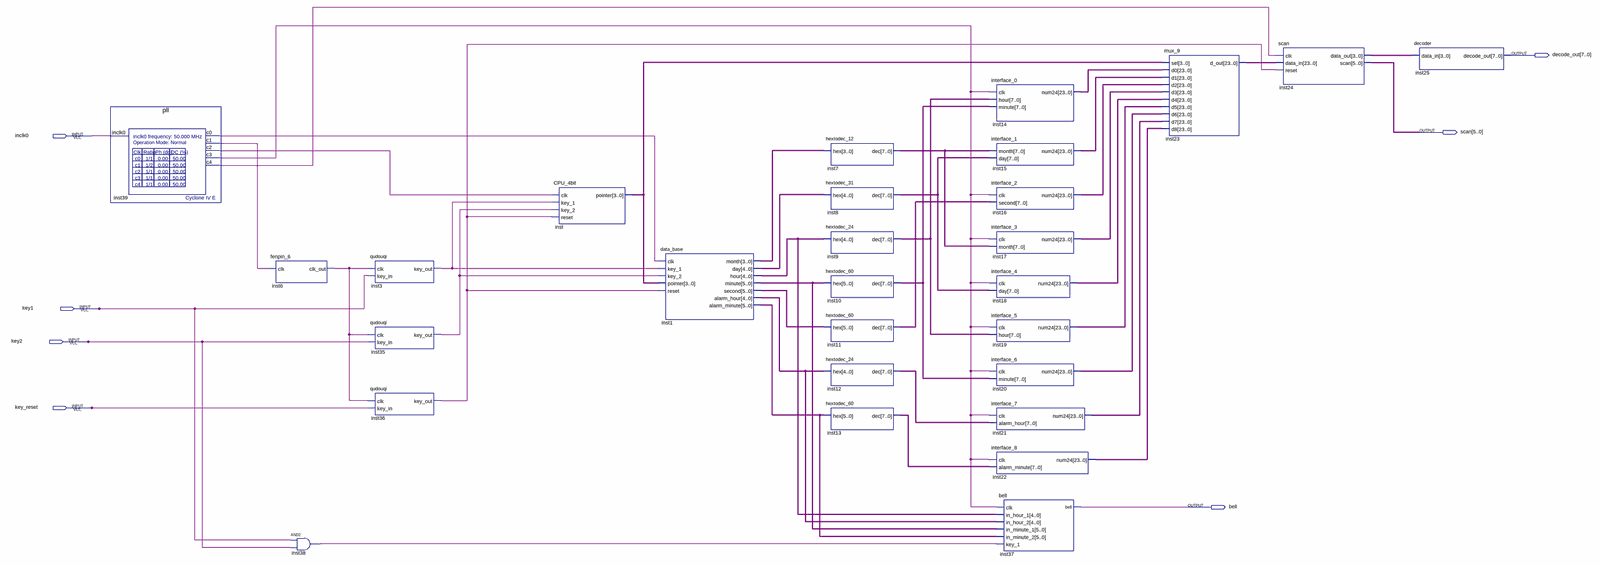
[diagram p0: schematic sheet, whole]
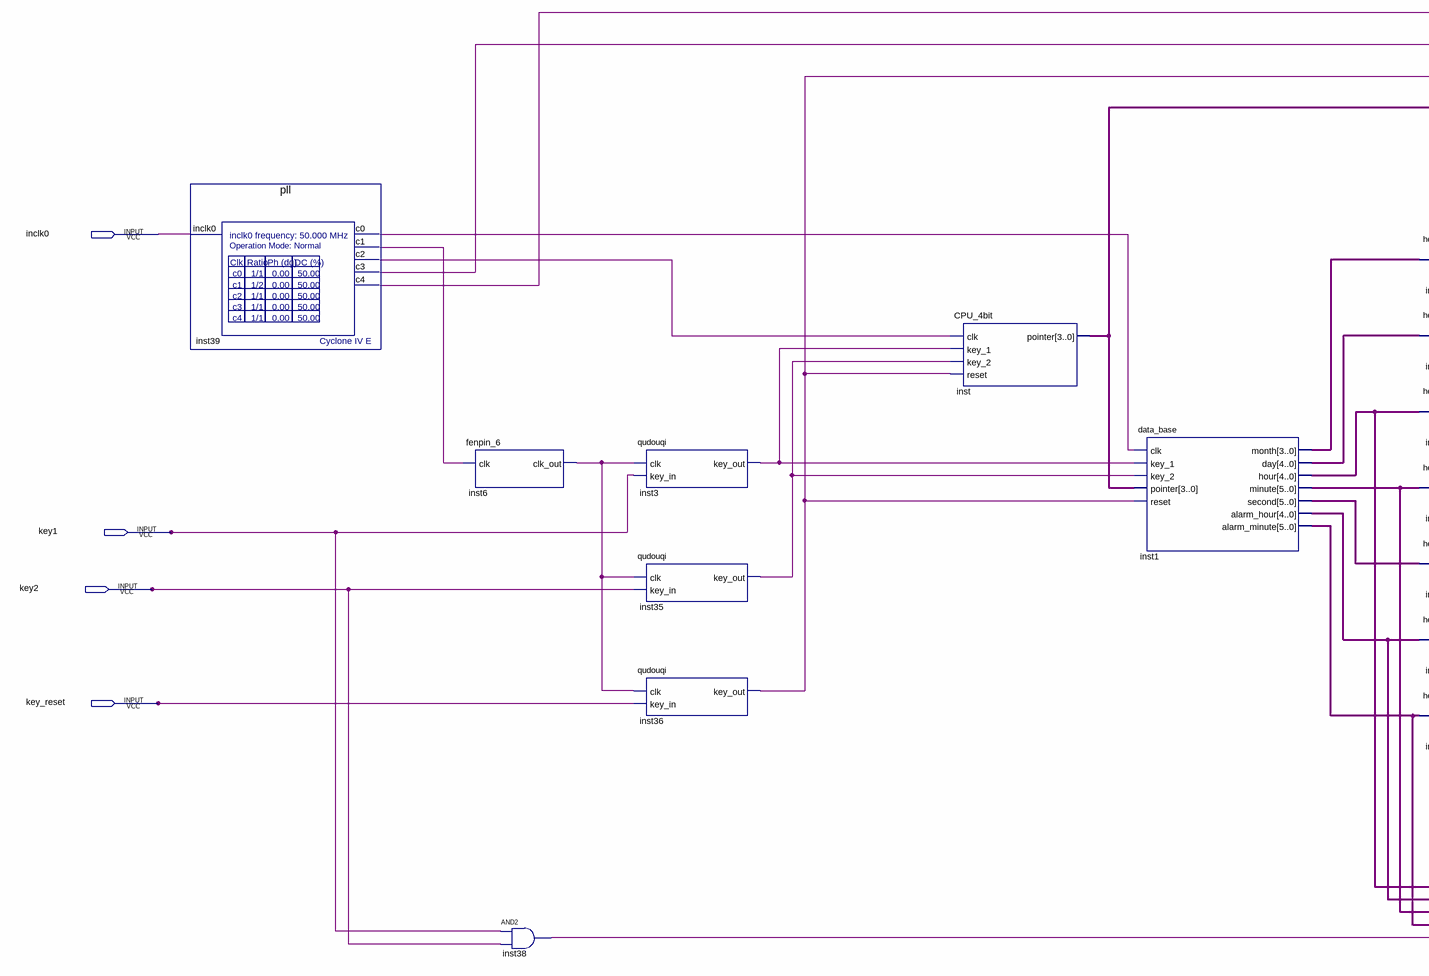
[diagram p1: schematic sheet, left part]
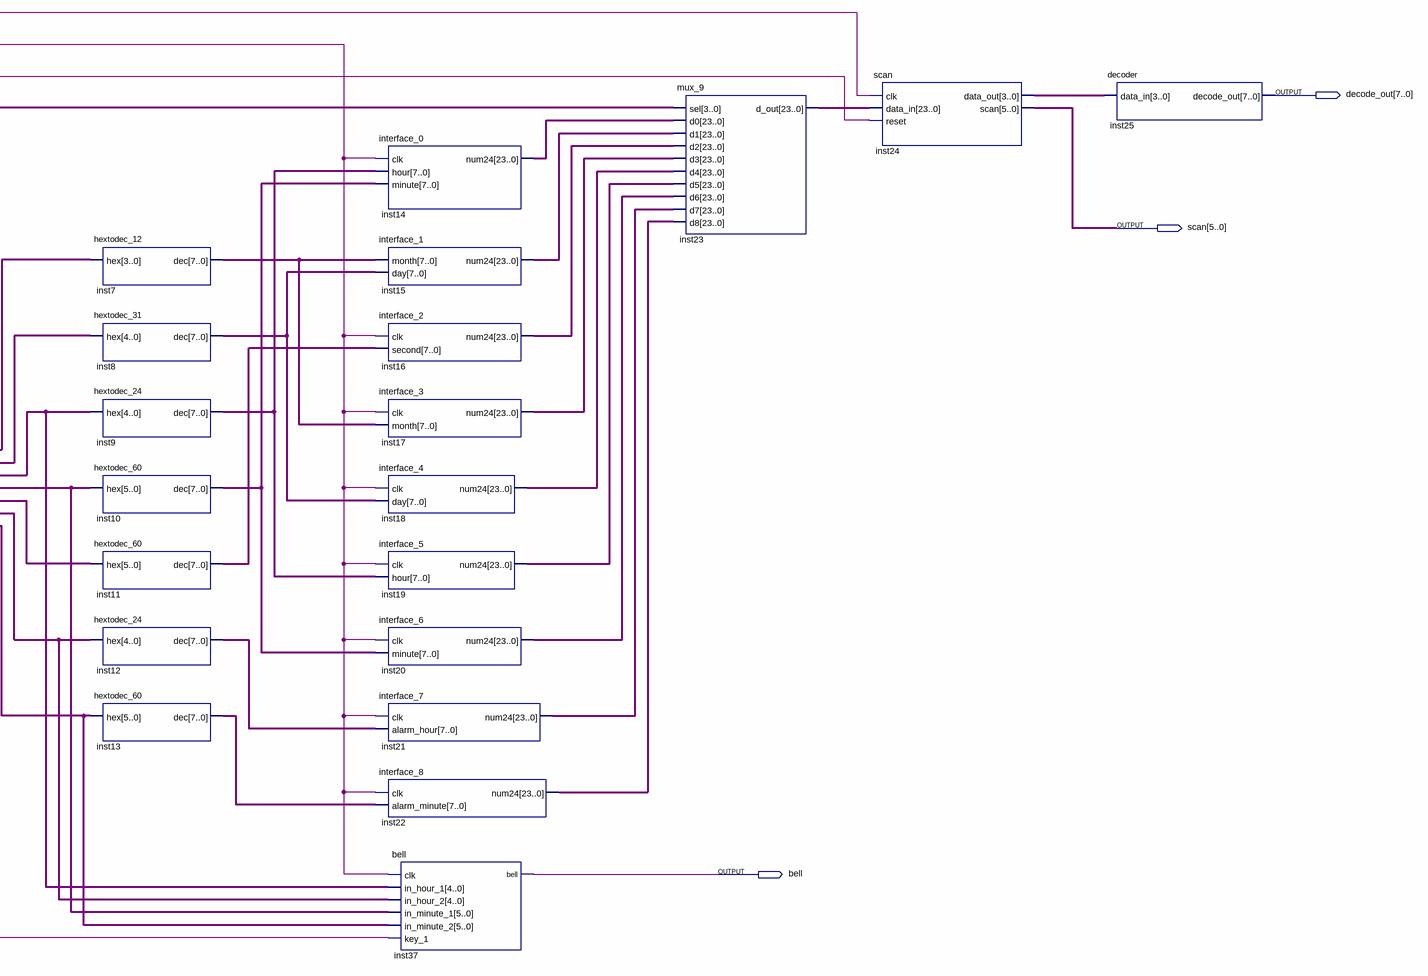
[diagram p2: schematic sheet, right part]
// Quartus schematic myDigitalClock.bdf as structural Verilog: 28 symbols, 7 pins
module myDigitalClock (
  input  inclk0,
  input  key1,
  input  key2,
  input  key_reset,
  output [7:0] decode_out,
  output [5:0] scan,
  output bell
);

  wire inst3_key_out, inst6_clk_out, inst35_key_out, inst36_key_out, inst38_out, inst39_c0, inst39_c1,
       inst39_c2, inst39_c3, inst39_c4;
  wire [3:0] inst1_month, inst24_data_out, inst_pointer;
  wire [4:0] inst1_alarm_hour, inst1_day, inst1_hour;
  wire [5:0] inst1_alarm_minute, inst1_minute, inst1_second;
  wire [7:0] inst7_dec, inst8_dec, inst9_dec, inst10_dec, inst11_dec, inst12_dec, inst13_dec;
  wire [23:0] inst14_num24, inst15_num24, inst16_num24, inst17_num24, inst18_num24, inst19_num24,
       inst20_num24, inst21_num24, inst22_num24, inst23_d_out;

  pll inst39 (.inclk0(inclk0), .c0(inst39_c0), .c1(inst39_c1), .c2(inst39_c2), .c3(inst39_c3), .c4(inst39_c4));
  fenpin_6 inst6 (.clk(inst39_c1), .clk_out(inst6_clk_out));
  and inst38 (inst38_out, key1, key2);
  qudouqi inst3 (.clk(inst6_clk_out), .key_in(key1), .key_out(inst3_key_out));
  qudouqi inst35 (.clk(inst6_clk_out), .key_in(key2), .key_out(inst35_key_out));
  qudouqi inst36 (.clk(inst6_clk_out), .key_in(key_reset), .key_out(inst36_key_out));
  CPU_4bit inst (
    .clk(inst39_c2), .key_1(inst3_key_out), .key_2(inst35_key_out), .reset(inst36_key_out),
    .pointer(inst_pointer));
  data_base inst1 (
    .clk(inst39_c0), .key_1(inst3_key_out), .key_2(inst35_key_out), .pointer(inst_pointer),
    .reset(inst36_key_out), .month(inst1_month), .day(inst1_day), .hour(inst1_hour), .minute(inst1_minute),
    .second(inst1_second), .alarm_hour(inst1_alarm_hour), .alarm_minute(inst1_alarm_minute));
  hextodec_12 inst7 (.hex(inst1_month), .dec(inst7_dec));
  hextodec_31 inst8 (.hex(inst1_day), .dec(inst8_dec));
  hextodec_24 inst9 (.hex(inst1_hour), .dec(inst9_dec));
  hextodec_60 inst10 (.hex(inst1_minute), .dec(inst10_dec));
  hextodec_60 inst11 (.hex(inst1_second), .dec(inst11_dec));
  hextodec_24 inst12 (.hex(inst1_alarm_hour), .dec(inst12_dec));
  hextodec_60 inst13 (.hex(inst1_alarm_minute), .dec(inst13_dec));
  interface_0 inst14 (.clk(inst39_c3), .hour(inst9_dec), .minute(inst10_dec), .num24(inst14_num24));
  interface_1 inst15 (.month(inst7_dec), .day(inst8_dec), .num24(inst15_num24));
  interface_2 inst16 (.clk(inst39_c3), .second(inst11_dec), .num24(inst16_num24));
  interface_3 inst17 (.clk(inst39_c3), .month(inst7_dec), .num24(inst17_num24));
  interface_4 inst18 (.clk(inst39_c3), .day(inst8_dec), .num24(inst18_num24));
  interface_5 inst19 (.clk(inst39_c3), .hour(inst9_dec), .num24(inst19_num24));
  interface_6 inst20 (.clk(inst39_c3), .minute(inst10_dec), .num24(inst20_num24));
  interface_7 inst21 (.clk(inst39_c3), .alarm_hour(inst12_dec), .num24(inst21_num24));
  interface_8 inst22 (.clk(inst39_c3), .alarm_minute(inst13_dec), .num24(inst22_num24));
  bell inst37 (
    .clk(inst39_c3), .in_hour_1(inst1_hour), .in_hour_2(inst1_alarm_hour), .in_minute_1(inst1_minute),
    .in_minute_2(inst1_alarm_minute), .key_1(inst38_out), .bell(bell));
  mux_9 inst23 (
    .sel(inst_pointer), .d0(inst14_num24), .d1(inst15_num24), .d2(inst16_num24), .d3(inst17_num24),
    .d4(inst18_num24), .d5(inst19_num24), .d6(inst20_num24), .d7(inst21_num24), .d8(inst22_num24),
    .d_out(inst23_d_out));
  scan inst24 (
    .clk(inst39_c4), .data_in(inst23_d_out), .reset(inst36_key_out), .data_out(inst24_data_out), .scan(scan));
  decoder inst25 (.data_in(inst24_data_out), .decode_out(decode_out));
endmodule
